# EAGLE design mainboard_v1 (EAGLE 7.1.0)
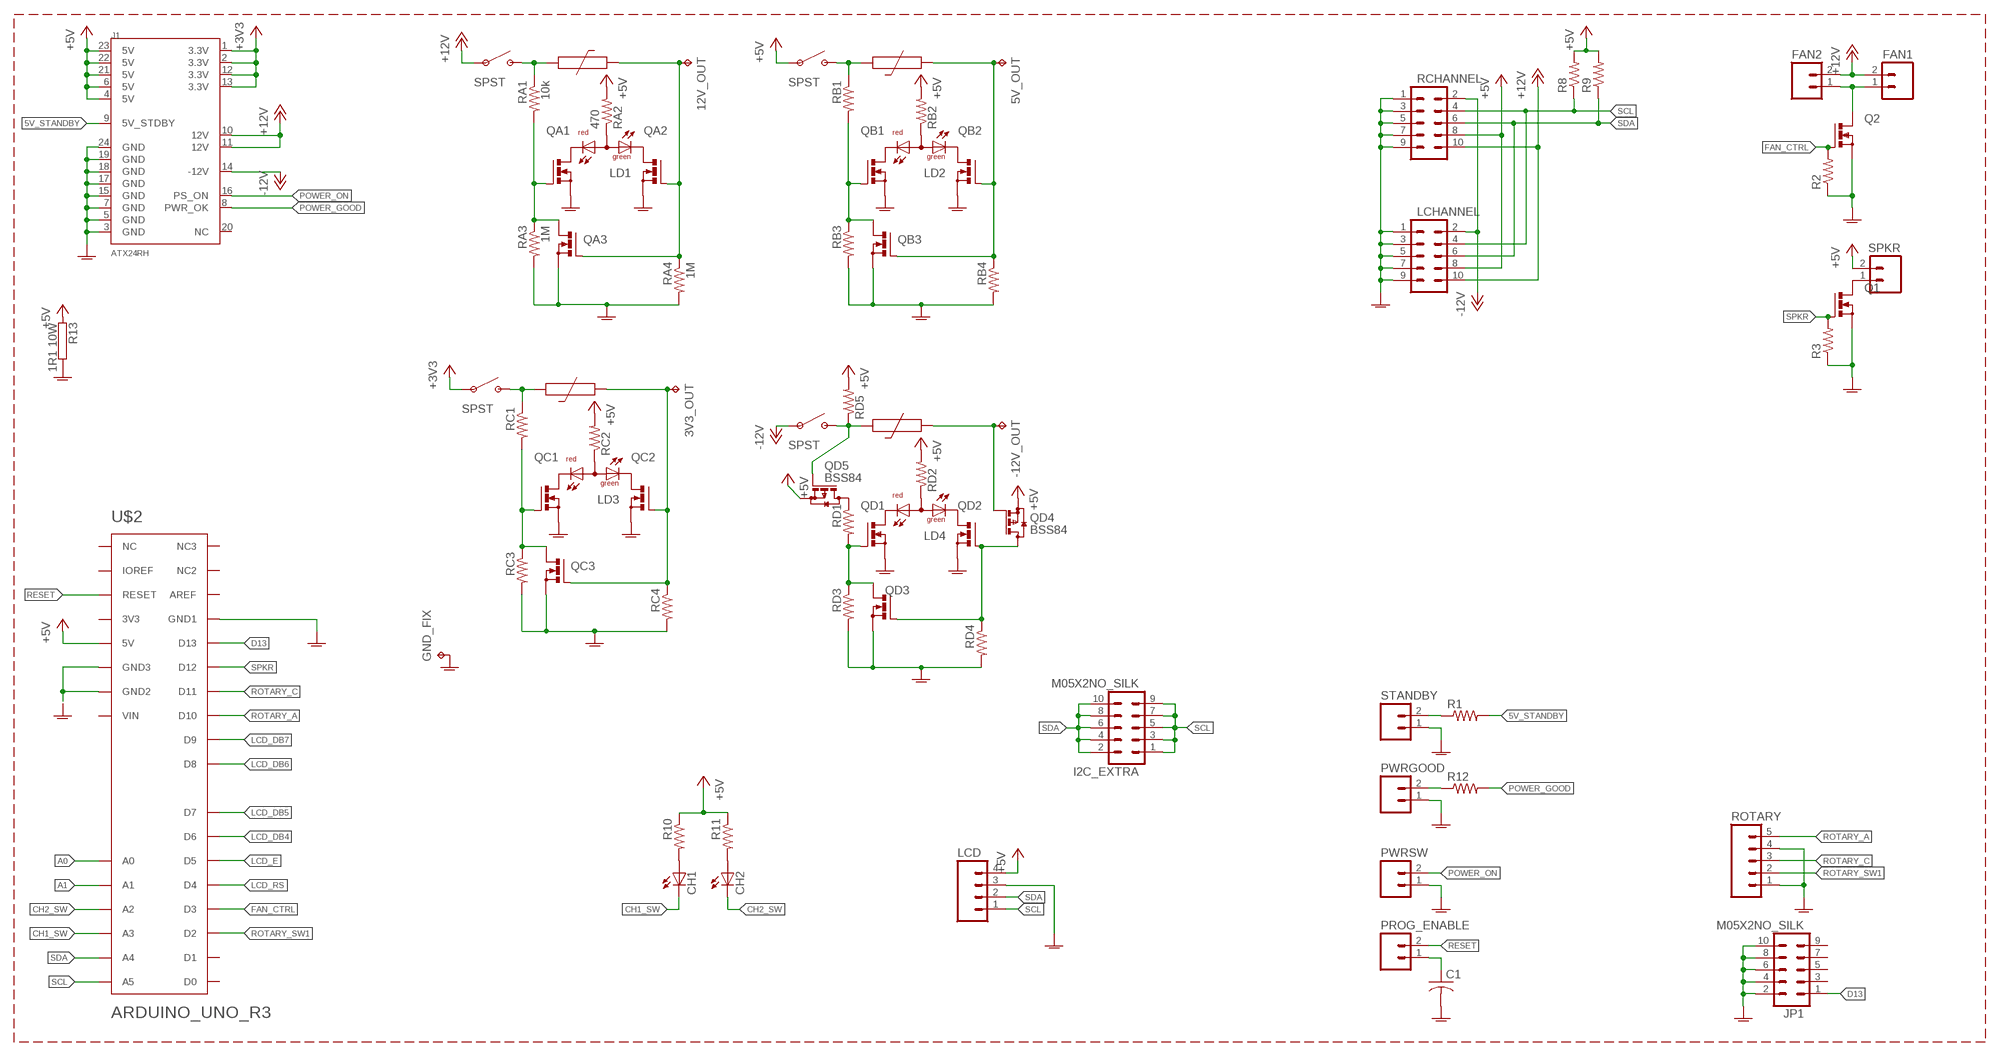
[diagram p0: schematic, sheet 1]

## Parts
3V3_OUT  TPPAD1-20  [P1-20]
5V_OUT  TPPAD1-20  [P1-20]
12V_OUT  TPPAD1-20  [P1-20]
-12V_OUT  TPPAD1-20  [P1-20]
C1  C-USC0805  [C0805]
CH1  LED5MM  [LED5MM]
CH2  LED5MM  [LED5MM]
FAN1  M02PTH  [1X02]
FAN2  M02PTH  [1X02]
GND_FIX  TPPAD1-20  [P1-20]
I2C_EXTRA  M05X2NO_SILK  [2X5_NOSILK]
J1  ATX24RH  [ATX24_RIGHT_ANGLE]
JP1  M05X2NO_SILK  [2X5_NOSILK]
LCD  M04  [04P]
LCHANNEL  M05X2SHD  [2X5-SHROUDED]
LD1  DUOLED-RG-A  [DUOLED-A-5MM]
LD2  DUOLED-RG-A  [DUOLED-A-5MM]
LD3  DUOLED-RG-A  [DUOLED-A-5MM]
LD4  DUOLED-RG-A  [DUOLED-A-5MM]
PROG_ENABLE  M02PTH  [1X02]
PWRGOOD  M02PTH  [1X02]
PWRSW  M02PTH  [1X02]
Q1  2N7002L  [SOT23]
Q2  2N7002L  [SOT23]
QA1  2N7002L  [SOT23]
QA2  2N7002L  [SOT23]
QA3  2N7002L  [SOT23]
QB1  2N7002L  [SOT23]
QB2  2N7002L  [SOT23]
QB3  2N7002L  [SOT23]
QC1  2N7002L  [SOT23]
QC2  2N7002L  [SOT23]
QC3  2N7002L  [SOT23]
QD1  2N7002L  [SOT23]
QD2  2N7002L  [SOT23]
QD3  2N7002L  [SOT23]
QD4  BSS84  [SOT23]
QD5  BSS84  [SOT23]
R1  R-US_R0805  [R0805]
R2  R-US_R0805  [R0805]
R3  R-US_R0805  [R0805]
R8  R-US_R0805  [R0805]
R9  R-US_R0805  [R0805]
R10  R-US_R0805  [R0805]
R11  R-US_R0805  [R0805]
R12  R-US_R0805  [R0805]
R13  1R1 10W  RMNS-5  [MNS-5]
RA1  10k  R-US_R0805  [R0805]
RA2  470  R-US_R0805  [R0805]
RA3  1M  R-US_R0805  [R0805]
RA4  1M  R-US_R0805  [R0805]
RB1  R-US_R0805  [R0805]
RB2  R-US_R0805  [R0805]
RB3  R-US_R0805  [R0805]
RB4  R-US_R0805  [R0805]
RC1  R-US_R0805  [R0805]
RC2  R-US_R0805  [R0805]
RC3  R-US_R0805  [R0805]
RC4  R-US_R0805  [R0805]
RCHANNEL  M05X2SHD  [2X5-SHROUDED]
RD1  R-US_R0805  [R0805]
RD2  R-US_R0805  [R0805]
RD3  R-US_R0805  [R0805]
RD4  R-US_R0805  [R0805]
RD5  R-US_R0805  [R0805]
ROTARY  M05  [05P]
SPKR  M02PTH  [1X02]
STANDBY  M02PTH  [1X02]
U$1  MF-R300  [MR-300]
U$2  ARDUINO_UNO_R3MINIMUM  [ARDUINO_UNO_R3_MIN]
U$3  MF-R300  [MR-300]
U$4  MF-R300  [MR-300]
U$5  MF-R300  [MR-300]
U$6  SPST  [2P_REMOTE]
U$8  SPST  [2P_REMOTE]
U$9  SPST  [2P_REMOTE]
U$10  SPST  [2P_REMOTE]

## Nets
5V_OUT: 5V_OUT.TP QB2.1(G) QB3.1(G) RB4.1 U$3.P$2
5V_OUT1: 3V3_OUT.TP QC2.1(G) QC3.1(G) RC4.1 U$4.P$2
5V_STANDBY: J1.9(5V_STDBY) R1.2
+3V3: J1.1(3.3V) J1.2(3.3V) J1.12(3.3V) J1.13(3.3V) U$9.1
+5V: J1.4(5V) J1.6(5V) J1.21(5V) J1.22(5V) J1.23(5V) LCD.4 LCHANNEL.8 QD4.2(S) QD5.2(S) R8.2 R9.2 R10.1 R11.1 R13.1 RA2.2 RB2.2 RC2.2 RCHANNEL.8 RD2.2 RD5.2 SPKR.2 U$2.5V U$8.1
+12V: FAN1.2 FAN2.2 J1.10(12V) J1.11(12V) LCHANNEL.10 RCHANNEL.10 U$6.1
-12V: J1.14(-12V) LCHANNEL.2 RCHANNEL.2 U$10.1
A0: U$2.A0
A1: U$2.A1
CH1_SW: CH1.K(C) U$2.A3
CH2_SW: CH2.K(C) U$2.A2
D13: JP1.1 U$2.D13
FAN_CTRL: Q2.1(G) R2.2 U$2.D3
GNDA: C1.2 GND_FIX.TP J1.3(GND) J1.5(GND) J1.7(GND) J1.15(GND) J1.17(GND) J1.18(GND) J1.19(GND) J1.24(GND) JP1.2 JP1.4 JP1.6 JP1.8 JP1.10 LCD.3 LCHANNEL.1 LCHANNEL.3 LCHANNEL.5 LCHANNEL.7 LCHANNEL.9 PWRGOOD.1 PWRSW.1 Q1.2(S) Q2.2(S) QA1.2(S) QA2.2(S) QA3.2(S) QB1.2(S) QB2.2(S) QB3.2(S) QC1.2(S) QC2.2(S) QC3.2(S) QD1.2(S) QD2.2(S) QD3.2(S) R2.1 R3.1 R13.2 RA3.2 RA4.2 RB3.2 RB4.2 RC3.2 RC4.2 RCHANNEL.1 RCHANNEL.3 RCHANNEL.5 RCHANNEL.7 RCHANNEL.9 RD3.2 RD4.2 ROTARY.1 ROTARY.4 STANDBY.1 U$2.GND2 U$2.GND3 U$2.GND(GND1)
LCD_DB4: U$2.D6
LCD_DB5: U$2.D7
LCD_DB6: U$2.D8
LCD_DB7: U$2.D9
LCD_E: U$2.D5
LCD_RS: U$2.D4
N$1: FAN1.1 FAN2.1 Q2.3(D)
N$2: R1.1 STANDBY.2
N$3: Q1.3(D) SPKR.1
N$4: CH1.A R10.2
N$5: CH2.A R11.2
N$9: LD2.A RB2.1
N$13: LD1.A RA2.1
N$14: LD1.CX(CG) QA2.3(D)
N$15: LD1.CR QA1.3(D)
N$16: LD2.CX(CG) QB2.3(D)
N$17: LD2.CR QB1.3(D)
N$18: PWRGOOD.2 R12.1
N$19: C1.1 PROG_ENABLE.1
N$20: RA1.1 U$1.P$2 U$6.2
N$21: LD3.CR QC1.3(D)
N$22: LD3.A RC2.1
N$23: LD3.CX(CG) QC2.3(D)
N$24: QD1.1(G) QD3.3(D) RD1.2 RD3.1
N$25: QD5.3(D) RD1.1
N$26: LD4.CR QD1.3(D)
N$27: 12V_OUT.TP QA2.1(G) QA3.1(G) RA4.1 U$1.P$1
N$28: QB1.1(G) QB3.3(D) RB1.2 RB3.1
N$29: RB1.1 U$3.P$1 U$8.2
N$30: LD4.A RD2.1
N$31: QA1.1(G) QA3.3(D) RA1.2 RA3.1
N$32: LD4.CX(CG) QD2.3(D)
N$33: QC1.1(G) QC3.3(D) RC1.2 RC3.1
N$34: RC1.1 U$4.P$1 U$9.2
N$36: -12V_OUT.TP QD4.1(G) U$5.P$2
N$39: QD5.1(G) RD5.1 U$5.P$1 U$10.2
N$40: QD2.1(G) QD3.1(G) QD4.3(D) RD4.1
POWER_GOOD: J1.8(PWR_OK) R12.2
POWER_ON: J1.16(PS_ON) PWRSW.2
RESET: PROG_ENABLE.2 U$2.RESET
ROTARY_A: ROTARY.5 U$2.D10
ROTARY_C: ROTARY.3 U$2.D11
ROTARY_SW1: ROTARY.2 U$2.D2
SCL: I2C_EXTRA.1 I2C_EXTRA.3 I2C_EXTRA.5 I2C_EXTRA.7 I2C_EXTRA.9 LCD.1 LCHANNEL.4 R8.1 RCHANNEL.4 U$2.A5
SDA: I2C_EXTRA.2 I2C_EXTRA.4 I2C_EXTRA.6 I2C_EXTRA.8 I2C_EXTRA.10 LCD.2 LCHANNEL.6 R9.1 RCHANNEL.6 U$2.A4
SPKR: Q1.1(G) R3.2 U$2.D12
Unconnected: J1.20(NC) JP1.3 JP1.5 JP1.7 JP1.9 U$2.3V3 U$2.AREF U$2.D0 U$2.D1 U$2.IOREF U$2.P$9(NC) U$2.P$10(NC2) U$2.P$19(NC3) U$2.VIN

## Library data of the parts
3V3_OUT 5V_OUT 12V_OUT -12V_OUT GND_FIX = testpad:TP: Test pad
C1 = rcl:C-US: CAPACITOR, American symbol
CH1 CH2 = led:LED: LED OSRAM: - CHIPLED LG R971, LG N971, LY N971, LG Q971, LY Q971, LO R971, LY R971 LH N974, LH R974 LS Q976, LO Q976, LY Q976 LO Q996 - Hyper CHIPLED LW Q18S LB Q993, LB Q99A, LB R99A - SideLED LS A670, LO A670, LY A670, LG A670, LP A670 LB A673, LV A673, LT A673, LW A673 LH A674 LY A675 LS A676, LA A676, LO A676, LY A676, LW A676 LS A679, LY A679, LG A679 - Hyper Micro SIDELED® LS Y876, LA Y876, LO Y876, LY Y876 LT Y87S - SmartLED LW L88C, LW L88S LB L89C, LB L89S, LG L890 LS L89K, LO L89K, LY L89K LS L896, LA L896, LO L896, LY L896 - TOPLED LS T670, LO T670, LY T670, LG T670, LP T670 LSG T670, LSP T670, LSY T670, LOP T670, LYG T670 LG T671, LOG T671, LSG T671 LB T673, LV T673, LT T673, LW T673 LH T674 LS T676, LA T676, LO T676, LY T676, LB T676, LH T676, LSB T676, LW T676 LB T67C, LV T67C, LT T67C, LS T67K, LO T67K, LY T67K, LW E67C LS E67B, LA E67B, LO E67B, LY E67B, LB E67C, LV E67C, LT E67C LW T67C LS T679, LY T679, LG T679 LS T770, LO T770, LY T770, LG T770, LP T770 LB T773, LV T773, LT T773, LW T773 LH T774 LS E675, LA E675, LY E675, LS T675 LS T776, LA T776, LO T776, LY T776, LB T776 LHGB T686 LT T68C, LB T68C - Hyper Mini TOPLED® LB M676 - Mini TOPLED Santana® LG M470 LS M47K, LO M47K, LY M47K Source: http://www.osram.convergy.de LUXEON: - LUMILED® LXK2-PW12-R00, LXK2-PW12-S00, LXK2-PW14-U00, LXK2-PW14-V00 LXK2-PM12-R00, LXK2-PM12-S00, LXK2-PM14-U00 LXK2-PE12-Q00, LXK2-PE12-R00, LXK2-PE12-S00, LXK2-PE14-T00, LXK2-PE14-U00 LXK2-PB12-K00, LXK2-PB12-L00, LXK2-PB12-M00, LXK2-PB14-N00, LXK2-PB14-P00, LXK2-PB14-Q00 LXK2-PR12-L00, LXK2-PR12-M00, LXK2-PR14-Q00, LXK2-PR14-R00 LXK2-PD12-Q00, LXK2-PD12-R00, LXK2-PD12-S00 LXK2-PH12-R00, LXK2-PH12-S00 LXK2-PL12-P00, LXK2-PL12-Q00, LXK2-PL12-R00 Source: www.luxeon.com KINGBRIGHT: KA-3528ASYC Source: www.kingbright.com
FAN1 FAN2 PROG_ENABLE PWRGOOD PWRSW SPKR STANDBY = SparkFun-Connectors:M02: Standard 2-pin 0.1" header. Use with - straight break away headers ( PRT-00116) - right angle break away headers (PRT-00553) - swiss pins (PRT-00743) - machine pins (PRT-00117) - female headers (PRT-00115) Molex polarized connector foot print use with: PRT-08233 with associated crimp pins and housings. 2.54_SCREWTERM for use with PRT-10571. 3.5mm Screw Terminal footprints for PRT-08084 5mm Screw Terminal footprints for use with PRT-08433
I2C_EXTRA JP1 LCHANNEL RCHANNEL = SparkFun-Connectors:M05X2: Header 5x2 Standard 10-pin dual row 0.1" header. Commonly used with AVR-ISP. Use with Spark Fun Electronics SKU: PRT-00778
J1 = SparkFun-Connectors:ATX24: ATX24 Pin Power Supply Connector This is a good connector for connecting a computer power supply to a PCB. It's massive, but provides many amps of power at 5V and 12V. SKU: PRT-09498
LCD = con-amp-quick:M04: AMP QUICK CONNECTOR; OC_FARNELL: unknown; OC_NEWARK: unknown
LD1-LD4 = led:DUOLED-RG-A: DUO LED 2 colors (red/green), 5 mm, round, common Anode www.ligitek.com or other producers.
Q1 Q2 QA1-QA3 QB1-QB3 QC1-QC3 QD1-QD3 = parts:2N7002L
QD4 QD5 = transistor-small-signal:BSS84: P-CHANNEL MOS FET
R1-R3 R8-R12 RA1-RA4 RB1-RB4 RC1-RC4 RD1-RD5 = rcl:R-US_: RESISTOR, American symbol
R13 = resistor-power:R: Power Resitor; OC_FARNELL: unknown; OC_NEWARK: unknown
ROTARY = con-amp-quick:M05: AMP QUICK CONNECTOR; OC_FARNELL: unknown; OC_NEWARK: unknown
U$1 U$3-U$5 = parts:MF-R300
U$2 = parts:ARDUINO_UNO_R3
U$6 U$8-U$10 = parts:SPST

## Board
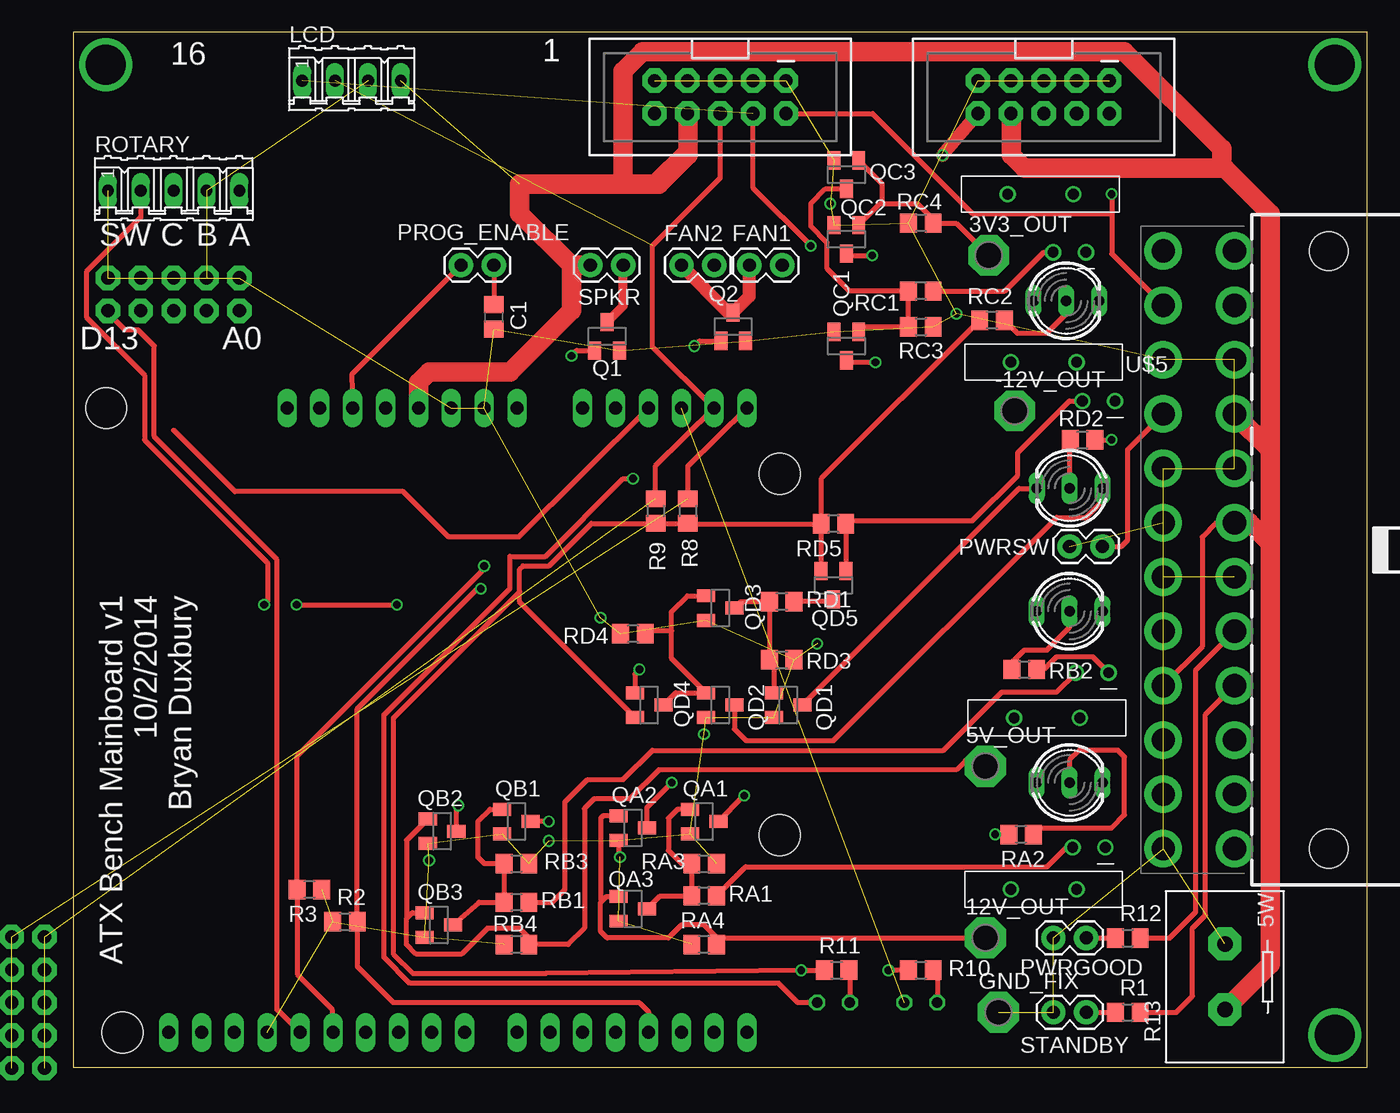
[diagram p1: board, top side]
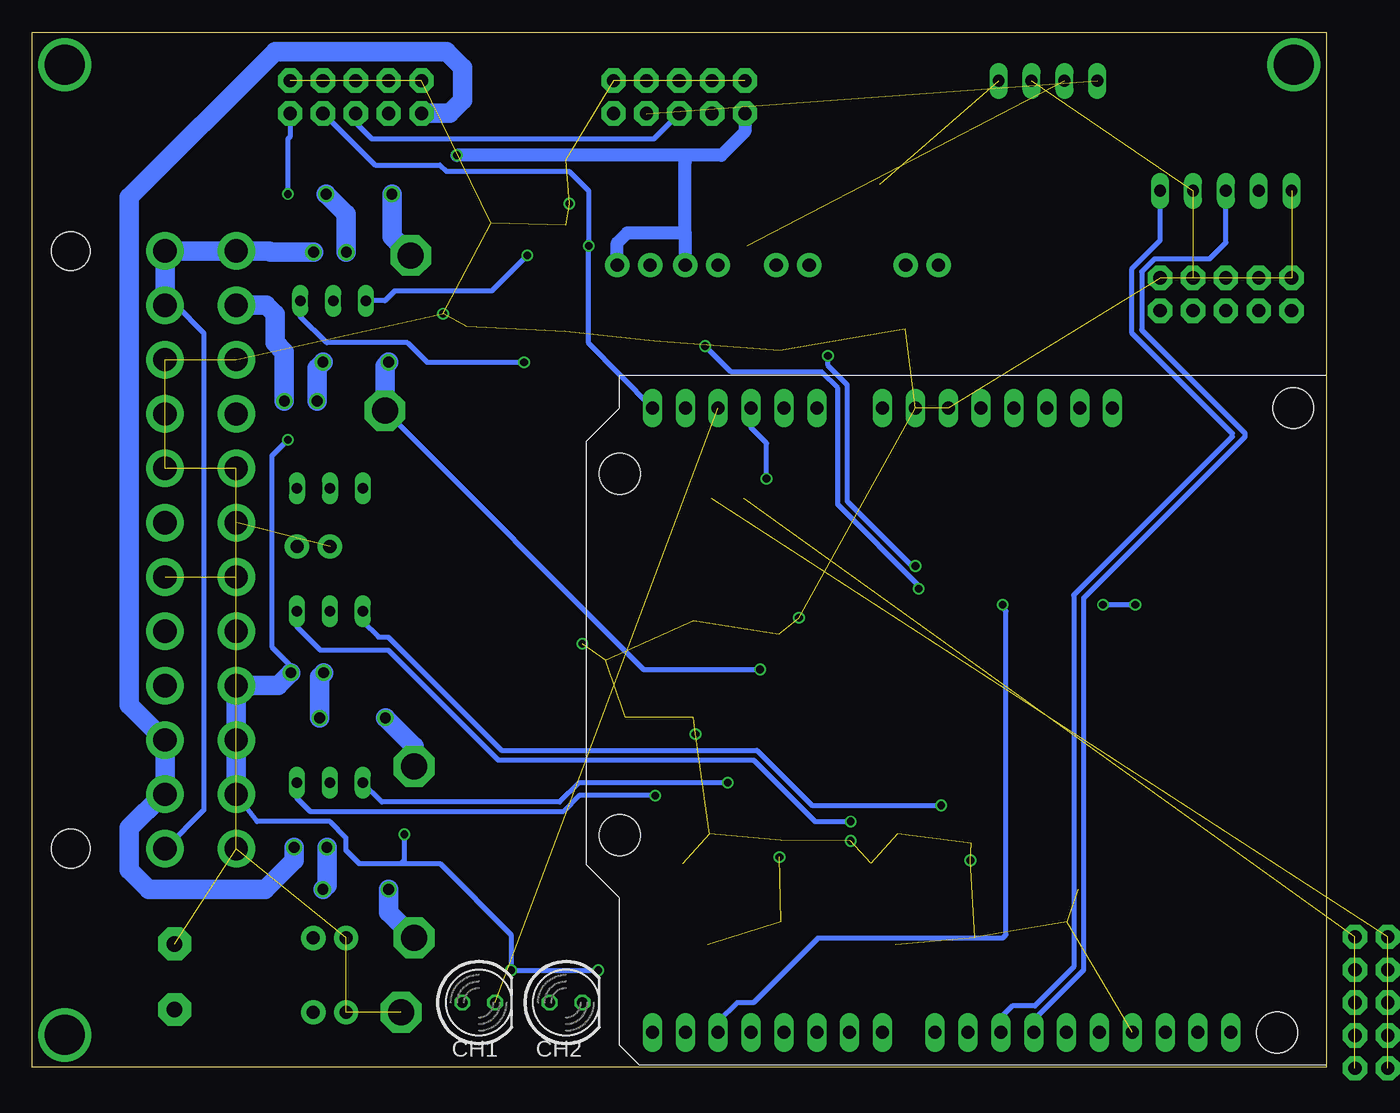
[diagram p2: board, bottom side, seen from below]

Size 100 x 80 mm. Coordinates in mm from the lower left corner, seen from the top.
Outline: 0,0 100,0 100,80 0,80 0,0
Copper layers (1*16): Top 0.035mm / dielectric 0.2mm / Bottom 0.035mm
Design rules "SeeedStudio_DRU_no_angle_20130527 *": minimum track width 6mil, minimum drill 12mil, track to track 6mil, track to pad 6mil, pad to pad 6mil, via to via 6mil, smd to smd 0mil, copper to edge 10mil, drill to drill 10mil, minimum pad ring 6mil, minimum via ring 6mil, stop-mask expansion 2mil, vias tented up to drill 25mil, thermal gap 10mil
tRestrict: area -1,74 to 6,81; area 94,74 to 101,81; area 94,-1 to 101,6
bRestrict: area -1,74 to 6,81; area 94,74 to 101,81; area 94,-1 to 101,6; area 51,14.2 to 58,21.3

### Footprints (pad centres in the part's own frame; a part is rotated, then mirrored left to right if it is on the bottom)
P1-20 = drill 2.007 pad 3.15 octagon: TP 0,0
C0805 = smd 1.3 x 1.5: 1 -0.95,0; 2 0.95,0
LED5MM = drill 0.813 octagon: A -1.27,0; K 1.27,0
1X02 = drill 1.016 pad 1.88: 1 0,0; 2 2.54,0
2X5_NOSILK = drill 1.016 pad 1.88 octagon: 1 -1.27,5.08; 2 1.27,5.08; 3 -1.27,2.54; 4 1.27,2.54; 5 -1.27,0; 6 1.27,0; 7 -1.27,-2.54; 8 1.27,-2.54; 9 -1.27,-5.08; 10 1.27,-5.08
ATX24_RIGHT_ANGLE = drill 1.8 pad 2.9: 1 23.1,4.76; 2 18.9,4.76; 3 14.7,4.76; 4 10.5,4.76; 5 6.3,4.76; 6 2.1,4.76; 7 -2.1,4.76; 8 -6.3,4.76; 9 -10.5,4.76; 10 -14.7,4.76; 11 -18.9,4.76; 12 -23.1,4.76; 13 23.1,10.26; 14 18.9,10.26; 15 14.7,10.26; 16 10.5,10.26; 17 6.3,10.26; 18 2.1,10.26; 19 -2.1,10.26; 20 -6.3,10.26; 21 -10.5,10.26; 22 -14.7,10.26; 23 -18.9,10.26; 24 -23.1,10.26 | hole 3: -23.1,-2.54; 23.1,-2.54
04P = drill 0.914 long: 1 -3.81,0; 2 -1.27,0; 3 1.27,0; 4 3.81,0
2X5-SHROUDED = drill 1.016 pad 1.88 octagon: 1 -1.27,5.08; 2 1.27,5.08; 3 -1.27,2.54; 4 1.27,2.54; 5 -1.27,0; 6 1.27,0; 7 -1.27,-2.54; 8 1.27,-2.54; 9 -1.27,-5.08; 10 1.27,-5.08
DUOLED-A-5MM = drill 0.813 long: A 0,0; CR 2.54,0; CX -2.54,0
SOT23 = smd 1 x 1.4: 1 -0.95,-1.1; 2 0.95,-1.1; 3 0,1.1
R0805 = smd 1.3 x 1.5: 1 -0.95,0; 2 0.95,0
MNS-5 = drill 1.194 pad 2.54 octagon: 1 -2.54,0; 2 2.54,0
05P = drill 0.914 long: 1 -5.08,0; 2 -2.54,0; 3 0,0; 4 2.54,0; 5 5.08,0
MR-300 = drill 0.838: P$1 -2.54,0; P$2 2.54,0
ARDUINO_UNO_R3_MIN = drill 1 long: 3V3 24.13,2.54; 5V 26.67,2.54; A0 39.37,2.54; A1 41.91,2.54; A2 44.45,2.54; A3 46.99,2.54; A4 49.53,2.54; A5 52.07,2.54; AREF 12.446,50.8; D0 52.07,50.8; D1 49.53,50.8; D2 46.99,50.8; D3 44.45,50.8; D4 41.91,50.8; D5 39.37,50.8; D6 36.83,50.8; D7 34.29,50.8; D8 30.226,50.8; D9 27.686,50.8; D10 25.146,50.8; D11 22.606,50.8; D12 20.066,50.8; D13 17.526,50.8; GND 14.986,50.8; GND2 31.75,2.54; GND3 29.21,2.54; IOREF 19.05,2.54; P$9 7.366,50.8; P$10 9.906,50.8; P$19 16.51,2.54; RESET 21.59,2.54; VIN 34.29,2.54 | hole 3.175: 3.81,50.8; 2.54,2.54; 54.61,7.62; 54.61,35.56
2P_REMOTE = drill 0.838: 1 -1.27,0; 2 1.27,0

### Placement (x,y rotation side)
3V3_OUT  70.75,62.75 0 top
5V_OUT  70.5,23.25 0 top
12V_OUT  70.5,10 0 top
-12V_OUT  72.75,50.75 0 top
C1  32.5,58 270 top
CH1  65.5,5 0 bottom
CH2  58.75,5 0 bottom
FAN1  52.25,62 0 top
FAN2  47,62 0 top
GND_FIX  71.5,4.25 0 top
I2C_EXTRA  -3.5,5 0 top
J1  94.5,40 90 top
JP1  7.75,59.75 90 top
LCD  21.5,76.25 0 top
LCHANNEL  75,75 270 top
LD1  77,22 0 top
LD2  77,35.25 0 top
LD3  76.75,59.25 0 top
LD4  77,44.75 180 top
PROG_ENABLE  32.5,62 180 top
PWRGOOD  75.75,10 0 top
PWRSW  77,40.25 0 top
Q1  41.25,56.5 0 top
Q2  51,57.25 0 top
QA1  48.75,19 270 top
QA2  43.25,18.5 270 top
QA3  43.25,12.25 270 top
QB1  34.25,19 270 top
QB2  28.5,18.25 270 top
QB3  28.25,11 270 top
QC1  59.75,55.75 180 top
QC2  59.75,64 180 top
QC3  59.75,69 180 top
QD1  55.25,28 270 top
QD2  50,28 270 top
QD3  50,35.5 270 top
QD4  44.5,28 270 top
QD5  58.75,37.25 180 top
R1  81.5,4.25 0 top
R2  21,11.25 0 top
R3  18.25,13.75 180 top
R8  47.5,43 270 top
R9  45,43 270 top
R10  65.5,7.5 0 top
R11  59,7.5 0 top
R12  81.5,10 0 top
R13  89,7 90 top
RA1  48.75,13.25 180 top
RA2  73.25,18 180 top
RA3  48.75,15.75 0 top
RA4  48.75,9.5 180 top
RB1  34.25,12.75 180 top
RB2  73.5,30.75 0 top
RB3  34.25,15.75 0 top
RB4  34.25,9.5 180 top
RC1  65.5,60 180 top
RC2  71,57.75 180 top
RC3  65.5,57.25 0 top
RC4  65.5,65.25 180 top
RCHANNEL  50,75 270 top
RD1  54.75,36 180 top
RD2  78,48.5 0 top
RD3  54.75,31.5 0 top
RD4  43.25,33.5 180 top
RD5  58.75,42 180 top
ROTARY  7.75,67.75 0 top
SPKR  42.5,62 180 top
STANDBY  75.75,4.25 0 top
U$1  75,13.75 0 top
U$2  0,53.5 180 bottom
U$3  75.25,27 180 top
U$4  74.75,67.5 180 top
U$5  75,54.5 180 top
U$6  78.5,17 180 top
U$8  78.75,30.5 180 top
U$9  77,63 180 top
U$10  79.25,51.5 180 top

### Tracks (layer width: path | path; a pad name or v marks a point on that pad's centre or on a via)
5V_OUT
  Top 0.4: 5V_OUT.TP 69.5,24.25 68.25,23 45.25,23 43,20.75 40.25,20.75 39.5,20 39.5,10.75 38.25,9.5 RB4.1 35.2,10.05 34.5,10.75 32,10.75 30,8.75 26.5,8.75 25.75,9.5 25.75,11.5 | 25.75,11.5 26.2,11.95 QB3.1 | QB2.1 25.75,17.55 25.75,11.5
  Bottom 1.5: U$3.P$2 70.5,24.79 5V_OUT.TP
5V_OUT1
  Top 0.4: 3V3_OUT.TP 68.25,65.25 RC4.1 66.45,65.55 65.25,66.75 62.5,66.75 | QC2.1 62.35,66.75 62.5,66.75 | QC3.1 62.5,68.3 62.5,66.75
  Bottom 1.5: U$4.P$2 72.21,64.21 3V3_OUT.TP
5V_STANDBY
  Top 0.4: R1.2 85.25,4.25 86.5,5.5 86.5,10.75 87.5,11.75 87.5,27.26 J1.9
+3V3
  Bottom 0.4: J1.2 88.9,58.9 86.75,56.75 86.75,19.89 J1.12
  Bottom 1.5: J1.2 J1.1 J1.13 81.69,63.1 81.59,63 U$9.1
+5V  (via drill 0.6)  (1 unrouted)
  Top 0.4: J1.6 88.35,42.1 87.25,41 87.25,32.51 J1.21 | R10.1 v63,7.5 | R11.1 v56.25,7.5 36.5,7.25 26.25,7.25 24.75,8.75 24.75,27 34.5,36.75 | RA2.2 v71.25,18 | RB2.2 74.5,30.8 75.05,30.8 76,31.75 78.77,31.75 U$8.1 | 34.5,36.75 34.5,38.5 34.75,38.75 36.75,38.75 40.05,42.05 R9.2 R8.2 47.55,42 RD5.2 | RD5.2 QD5.2 | QD4.2 34.5,35.95 34.5,36.75 | RD2.2 v80.25,48.5 | RC2.2 57.8,45.5 RD5.2
  Top 1: LCHANNEL.8 72.5,73.69 | 88.75,69.5 89,69.5
  Top 1.5: R13.1 92.5,7.96 92.5,40.5 | 92.5,40.5 90.9,42.1 J1.6 | J1.4 92.5,47.74 | 92.5,47.74 92.5,40.5 | 72.5,73.69 72.5,70.5 73.5,69.5 88.75,69.5 88.75,71 81.25,78.5 44,78.5 42.5,77 42.5,68.25 | 89,69.5 92.5,66 92.5,47.74 | 38.5,62 34.5,66 34.5,68.25 42.5,68.25 | 38.5,62 SPKR.2 | RCHANNEL.8 47.5,73.69 47.5,70.75 | 47.5,70.75 47.5,70.5 45.25,68.25 45,68.25 | 38.5,62 38.5,58.5 33.75,53.75 27.5,53.75 26.67,52.92 U$2.5V | 47.5,70.75 45,68.25 | 45,68.25 42.5,68.25
  Bottom 0.4: v56.25,7.5 v63,7.5 63,10.25 68.5,15.75 71.5,15.75 | 71.5,15.75 74.75,15.75 75.75,16.75 75.75,17.75 77,19 82.64,19 J1.23 | v71.25,18 71.25,16 71.5,15.75 | v80.25,48.5 81.5,47.25 81.5,32.5 80.02,31.02 U$8.1
  Bottom 1.5: J1.23 J1.22 J1.21 81.02,29.5 U$8.1
+12V  (via drill 0.6)
  Top 1: v67.19,70.5 LCHANNEL.10
  Bottom 1: RCHANNEL.10 44.92,72.33 46.75,70.5 49.5,70.5 | 49.5,70.5 v67.19,70.5 | 49.54,64.5 49.54,69.96 49.5,70.5 | FAN1.2 54.79,63.71 54,64.5 49.54,64.5 | 49.54,64.5 FAN2.2
  Bottom 1.5: LCHANNEL.10 69.9,73.75 67.75,73.75 66.75,74.75 66.75,77.25 68,78.5 81.25,78.5 92.5,67.25 92.5,28 89.8,25.3 J1.10 J1.11 89.9,21.1 92.5,18.5 92.5,15.25 91,13.75 82,13.75 79.77,15.98 U$6.1
-12V  (via drill 0.6)
  Top 0.4: v80.25,67.5 80.25,66 | 80.25,66 80.25,62.89 J1.14 | RCHANNEL.2 61.77,73.73 69.5,66 80.25,66
  Bottom 0.4: LCHANNEL.2 80.08,71.92 80.25,71.75 v80.25,67.5
  Bottom 1.5: J1.14 81.94,58.9 81.25,58.21 81.25,56 80.52,55.27 U$10.1
CH1_SW  (1 unrouted)
CH2_SW  (via drill 0.6)
  Top 0.4: U$2.A2 34.42,41 29,41 25.5,44.5 12.5,44.5 7.75,49.25 | CH2.K 56,5 54.5,6.5 26,6.5 24,8.5 24,27.25 33.75,37 33.75,39.5 36.5,39.5 42.5,45.5 v43.25,45.5
  Bottom 0.4: v43.25,45.5 43.25,48.25 44.45,49.45 U$2.A2
D13
  Top 0.4: JP1.1 2.67,58.33 4,57 5,57 6.25,55.75 6.25,48.75 15.75,39.25 15.75,4.41 15.82,4.41 U$2.D13
FAN_CTRL  (via drill 0.6)
  Top 0.4: U$2.D3 44.5,2.75 | v48,55.75 48.4,56.15 Q2.1 | 44.45,3.75 U$2.D3 | U$2.D3 44.45,4.3 43.75,5 24.75,5 21.95,7.8 R2.2 21.95,27.7 31.25,37 v31.5,37
  Bottom 0.4: v48,55.75 46,53.75 39,53.75 37.75,52.5 37.75,43.5 31.5,37.25 v31.5,37
GNDA  (via drill 0.6)  (65 unrouted)
  Top 0.4: QA2.2 42.15,16.35 v42.25,16.25
  other vias: 68.25,58.25 58.5,66.75 27.5,16 36.75,17.5 48.75,25.75 40.75,34.75 57.5,32.75
N$1
  Top 1: FAN1.1 52.25,59.6 Q2.3 50.65,58.35 FAN2.1
N$2
  Top 0.4: STANDBY.2 R1.1
N$3
  Top 0.7: Q1.3 42.5,58.85 SPKR.1
N$4
  Top 0.4: R10.2 66.77,7.18 CH1.A
N$5
  Top 0.4: R11.2 60.02,7.43 CH2.A
N$7  (via drill 3.1)
  other vias: 97.5,77.5
N$8  (via drill 3.1)
  other vias: 97.5,2.5
N$9
  Top 0.4: RB2.1 72.55,31.3 73.5,32.25 75.25,32.25 77,34 LD2.A
N$10  (via drill 3.1)
  other vias: 2.5,77.5
N$13
  Top 0.4: RA2.1 74.7,18.5 80.25,18.5 81.25,19.5 81.25,24 80.75,24.5 77.75,24.5 77,23.75 LD1.A
N$14  (via drill 0.6)
  Top 0.4: QA2.3 44.35,20.1 v46.25,22
  Bottom 0.4: LD1.CX 74.46,21.96 73,20.5 59.25,20.5 57.75,22 v46.25,22
N$15  (via drill 0.6)
  Top 0.4: QA1.3 v51.85,21
  Bottom 0.4: v51.85,21 57.75,21 59,19.75 78.5,19.75 79.54,20.79 LD1.CR
N$16  (via drill 0.6)
  Top 0.4: v29.75,20.25 29.6,20.1 QB2.3
  Bottom 0.4: LD2.CX 74.46,34.46 73.25,33.25 72.5,33.25 63.75,24.5 44,24.5 39.75,20.25 v29.75,20.25
N$17  (via drill 0.6)
  Top 0.4: v36.75,19 QB1.3
  Bottom 0.4: LD2.CR 79.54,34.04 77.75,32.25 72.5,32.25 64,23.75 44.25,23.75 39.5,19 v36.75,19
N$18
  Top 0.4: PWRGOOD.2 R12.1
N$19
  Top 0.4: PROG_ENABLE.1 C1.1
N$20
  Top 0.4: RA1.1 51.95,15.5 75.25,15.5 76.75,17 U$6.2
  Bottom 1.5: U$6.2 77.23,14.06 U$1.P$2
N$21  (via drill 0.6)
  Top 0.4: QC1.3 59.9,54.5 v62,54.5
  Bottom 0.4: LD3.CR 79.29,58.04 77.25,56 71,56 69.5,54.5 v62,54.5
N$22
  Top 0.4: RC2.1 72.95,56.75 75.25,56.75 76.75,58.25 LD3.A
N$23  (via drill 0.6)
  Top 0.4: QC2.3 59.9,62.75 v61.75,62.75
  Bottom 0.4: v61.75,62.75 64.5,60 72,60 72.75,59.25 LD3.CX
N$24
  Top 0.4: QD1.1 54.15,31.15 RD3.1 RD1.2 51.6,36 QD3.3
N$25
  Top 0.4: QD5.3 58.6,36 RD1.1
N$26
  Top 0.4: QD1.3 73.1,44.75 LD4.CR
N$27
  Top 0.4: 40.88,12.88 40.75,12.75 40.75,10.5 41.25,10 46,10 47,11 48.75,11 49.7,10.05 RA4.1 50.2,10 12V_OUT.TP | 40.88,12.88 41.2,13.2 QA3.1 | QA2.1 40.95,19.45 40.75,19.25 40.75,13 40.88,12.88
  Bottom 1.5: U$1.P$1 72.46,11.96 12V_OUT.TP
N$28
  Top 0.4: QB3.3 31.35,12.75 RB1.2 RB3.1 31.75,15.75 31.25,16.25 31.25,19 32.2,19.95 QB1.1
N$29
  Top 0.4: U$8.2 75.98,29 71.75,29 67.25,24.5 44.75,24.5 42.5,22.25 39.75,22.25 38,20.5 38,13.75 37,12.75 RB1.1
  Bottom 1.5: U$8.2 77.79,30.19 U$3.P$1
N$30
  Top 0.4: RD2.1 77,48.45 LD4.A
N$31
  Top 0.4: QA1.1 46.7,19.95 46,19.25 46,16.75 47,15.75 RA3.1 RA1.2 45.35,13.25 QA3.3
N$32
  Top 0.4: QD2.3 51.1,26.15 52,25.25 58.75,25.25 76,42.5 78.25,42.5 79.54,43.79 LD4.CX
N$33
  Top 0.4: 64.15,56.85 RC3.1 | QC1.1 61.1,57.25 RC3.1 | RC3.1 RC1.2 60,60 58.25,61.75 58.25,63.75 57,65 57,66.75 58.15,67.9 QC3.3
N$34
  Top 0.4: U$9.2 75,63 72,60 RC1.1
  Bottom 1.5: U$9.2 75.73,65.94 U$4.P$1
N$36  (via drill 0.6)
  Top 0.4: v43.75,30.75 43.4,30.4 QD4.1
  Bottom 0.4: -12V_OUT.TP 52.75,30.75 v43.75,30.75
  Bottom 1.5: U$5.P$2 72.75,54.21 -12V_OUT.TP
N$39
  Top 0.4: QD5.1 RD5.1 59.95,42.25 69.5,42.25 73,45.75 73,47.5 77,51.5 U$10.2
  Bottom 1.5: U$5.P$1 77.98,54.06 U$10.2
N$40
  Top 0.4: 46.25,33.75 46.25,31.6 QD2.1 46.55,28.95 QD4.3 | 46.25,33.75 46.25,35.25 47.45,36.45 QD3.1 | RD4.1 44.45,33.75 46.25,33.75
POWER_GOOD
  Top 0.4: R12.2 84.75,10 86.75,12 86.75,30.71 J1.8
POWER_ON
  Top 0.4: PWRSW.2 81,40.25 81.5,40.75 81.5,47.76 J1.16
RESET
  Top 0.4: PROG_ENABLE.2 21.52,53.56 U$2.RESET
ROTARY_A
  Bottom 0.4: ROTARY.5 12.83,63.92 15,61.75 15,56.75 7.25,49 7.25,48.75 19.5,36.5 19.5,7.75 22.5,4.75 24.25,4.75 25.08,3.92 25.08,2.77 U$2.D10
ROTARY_C
  Bottom 0.4: ROTARY.3 7.75,63.75 9,62.5 13.25,62.5 14.25,61.5 14.25,57 6.25,49 6.25,48.75 18.75,36.25 18.75,7.5 22.54,3.71 22.54,2.77 U$2.D11
ROTARY_SW1  (via drill 0.6)
  Top 0.4: ROTARY.2 5.21,65.71 1,61.5 1,58 5.5,53.5 5.5,48.5 15,39 15,36 v14.75,35.75 | v17.25,35.75 v25,35.75
  Bottom 0.4: v14.75,35.75 v17.25,35.75 | v25,35.75 24.75,35.25 24.75,10.25 25,10 39.25,10 44.25,5 45.5,5 46.99,3.51 U$2.D2
SCL  (via drill 0.6)  (6 unrouted)
  Top 0.4: R8.1 47.5,46.46 U$2.A5 | v57,63.5 52.54,67.96 RCHANNEL.4
  Bottom 0.4: U$2.A5 57,55.96 v57,63.5 57,67.75 58.5,69.25 68,69.25 68.5,69.75 73.5,69.75 77.48,73.73 LCHANNEL.4
SDA  (6 unrouted)
  Top 0.4: R9.1 45,46.5 U$2.A4 44.75,55.67 44.75,63.5 50,68.75 RCHANNEL.6
  Bottom 0.4: RCHANNEL.6 51.98,71.75 73.75,71.75 75,73 LCHANNEL.6
SPKR  (via drill 0.6)
  Top 0.4: v38.5,55 38.9,55.4 Q1.1 | 20.05,2.72 U$2.D12 20,2.77 20,4.5 17.3,7.2 R3.2 17.3,24.05 31.75,38.5 v31.75,38.75
  Bottom 0.4: v38.5,55 38.5,54.25 37,52.75 37,43.75 32,38.75 v31.75,38.75

### Text on the board
tNames: 16 | 1 | SW | C | B | A | D13 | A0 | ATX Bench Mainboard v1 / 10/2/2014 / Bryan Duxbury